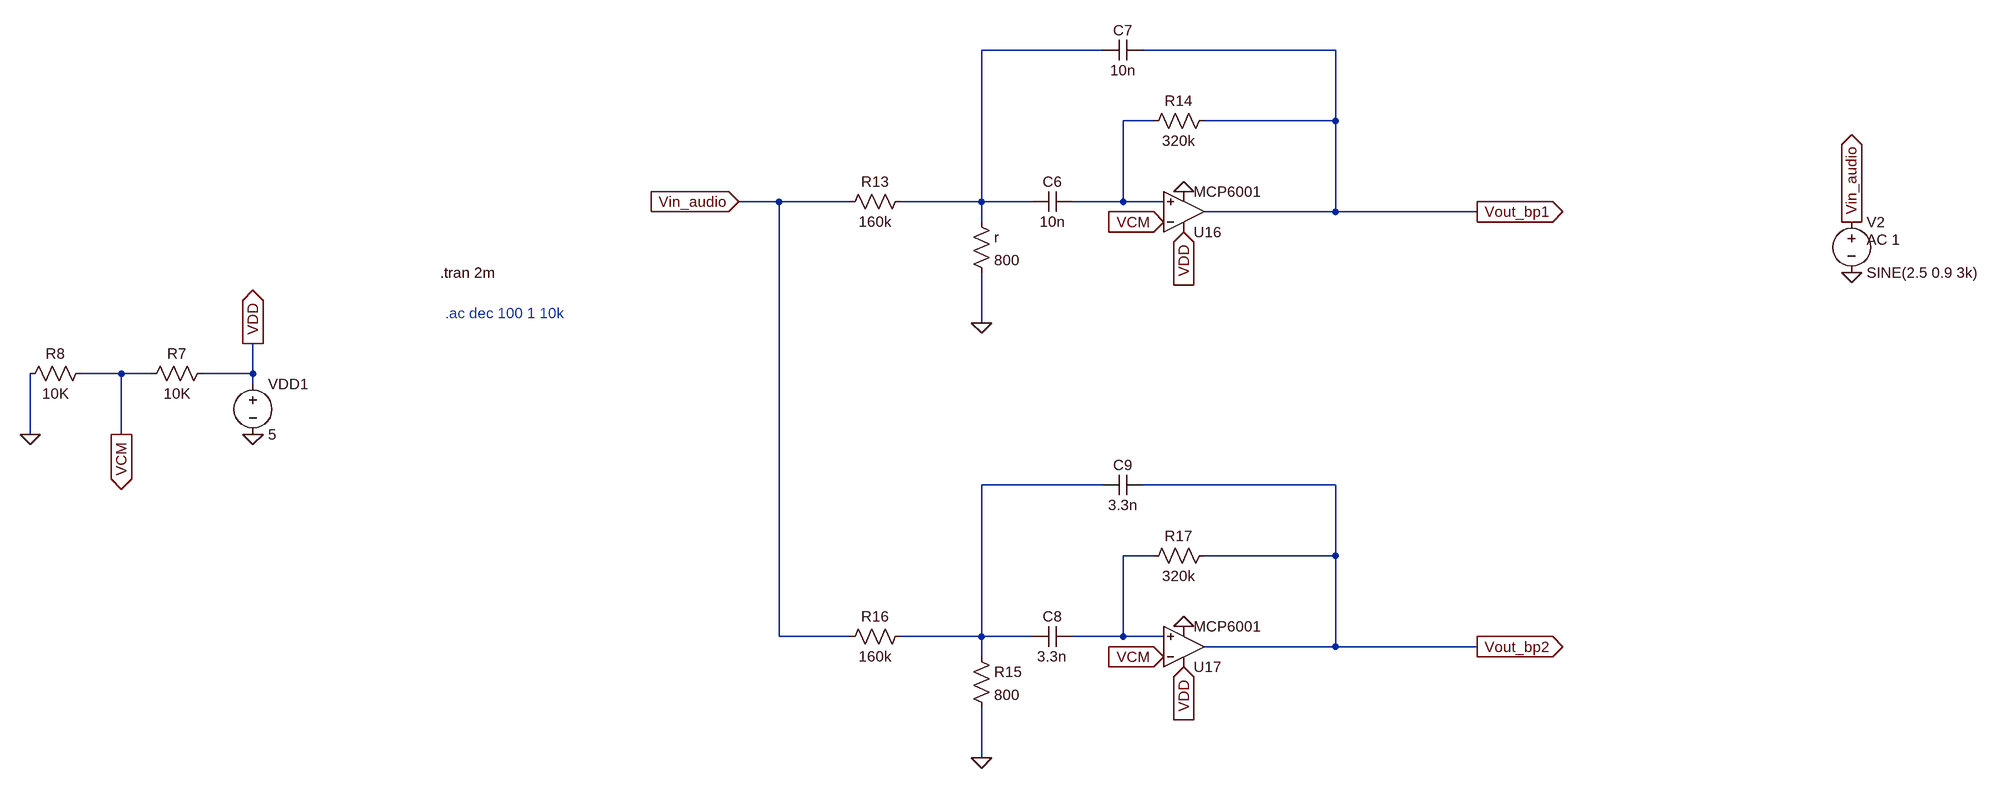
[diagram p0: schematic prelab_6.asc]
prelab_6.asc, the LTspice schematic file:
Version 4.1
SHEET 1 5788 1552
WIRE 4384 -432 4192 -432
WIRE 4752 -432 4448 -432
WIRE 4464 -320 4416 -320
WIRE 4752 -320 4752 -432
WIRE 4752 -320 4544 -320
WIRE 3872 -192 3808 -192
WIRE 3984 -192 3872 -192
WIRE 4192 -192 4192 -432
WIRE 4192 -192 4064 -192
WIRE 4272 -192 4192 -192
WIRE 4416 -192 4416 -320
WIRE 4416 -192 4336 -192
WIRE 4480 -192 4416 -192
WIRE 4752 -176 4752 -320
WIRE 4752 -176 4544 -176
WIRE 4976 -176 4752 -176
WIRE 4192 -160 4192 -192
WIRE 4192 0 4192 -80
WIRE 2832 80 2768 80
WIRE 2880 80 2832 80
WIRE 3040 80 3040 32
WIRE 3040 80 2960 80
WIRE 3040 96 3040 80
WIRE 2688 176 2688 80
WIRE 2832 176 2832 80
WIRE 4384 256 4192 256
WIRE 4752 256 4448 256
WIRE 4464 368 4416 368
WIRE 4752 368 4752 256
WIRE 4752 368 4544 368
WIRE 3872 496 3872 -192
WIRE 3984 496 3872 496
WIRE 4192 496 4192 256
WIRE 4192 496 4064 496
WIRE 4272 496 4192 496
WIRE 4416 496 4416 368
WIRE 4416 496 4336 496
WIRE 4480 496 4416 496
WIRE 4752 512 4752 368
WIRE 4752 512 4544 512
WIRE 4976 512 4752 512
WIRE 4192 528 4192 496
WIRE 4192 688 4192 608
FLAG 3040 176 0
FLAG 3040 32 VDD
IOPIN 3040 32 Out
FLAG 2832 176 VCM
IOPIN 2832 176 Out
FLAG 2688 176 0
FLAG 4976 -176 Vout_bp1
IOPIN 4976 -176 Out
FLAG 4192 0 0
FLAG 3808 -192 Vin_audio
IOPIN 3808 -192 In
FLAG 4480 -160 VCM
IOPIN 4480 -160 In
FLAG 4976 512 Vout_bp2
IOPIN 4976 512 Out
FLAG 4192 688 0
FLAG 4480 528 VCM
IOPIN 4480 528 In
FLAG 4512 -144 VDD
IOPIN 4512 -144 In
FLAG 4512 544 VDD
IOPIN 4512 544 In
FLAG 4512 -208 0
FLAG 4512 480 0
FLAG 5568 -80 0
FLAG 5568 -160 Vin_audio
IOPIN 5568 -160 Out
SYMBOL voltage 3040 80 R0
WINDOW 123 0 0 Left 0
WINDOW 39 0 0 Left 0
SYMATTR InstName VDD1
SYMATTR Value 5
SYMBOL res 2976 64 R90
WINDOW 0 0 56 VBottom 2
WINDOW 3 32 56 VTop 2
SYMATTR InstName R7
SYMATTR Value 10K
SYMBOL res 2784 64 R90
WINDOW 0 0 56 VBottom 2
WINDOW 3 32 56 VTop 2
SYMATTR InstName R8
SYMATTR Value 10K
SYMBOL MCP6001 4512 -176 M180
SYMATTR InstName U16
SYMBOL cap 4336 -208 R90
WINDOW 0 0 32 VBottom 2
WINDOW 3 32 32 VTop 2
SYMATTR InstName C6
SYMATTR Value 10n
SYMBOL res 4176 -176 R0
SYMATTR InstName r
SYMATTR Value 800
SYMBOL res 4080 -208 R90
WINDOW 0 0 56 VBottom 2
WINDOW 3 32 56 VTop 2
SYMATTR InstName R13
SYMATTR Value 160k
SYMBOL cap 4448 -448 R90
WINDOW 0 0 32 VBottom 2
WINDOW 3 32 32 VTop 2
SYMATTR InstName C7
SYMATTR Value 10n
SYMBOL res 4560 -336 R90
WINDOW 0 0 56 VBottom 2
WINDOW 3 32 56 VTop 2
SYMATTR InstName R14
SYMATTR Value 320k
SYMBOL MCP6001 4512 512 M180
SYMATTR InstName U17
SYMBOL cap 4336 480 R90
WINDOW 0 0 32 VBottom 2
WINDOW 3 32 32 VTop 2
SYMATTR InstName C8
SYMATTR Value 3.3n
SYMBOL res 4176 512 R0
SYMATTR InstName R15
SYMATTR Value 800
SYMBOL res 4080 480 R90
WINDOW 0 0 56 VBottom 2
WINDOW 3 32 56 VTop 2
SYMATTR InstName R16
SYMATTR Value 160k
SYMBOL cap 4448 240 R90
WINDOW 0 0 32 VBottom 2
WINDOW 3 32 32 VTop 2
SYMATTR InstName C9
SYMATTR Value 3.3n
SYMBOL res 4560 352 R90
WINDOW 0 0 56 VBottom 2
WINDOW 3 32 56 VTop 2
SYMATTR InstName R17
SYMATTR Value 320k
SYMBOL voltage 5568 -176 R0
WINDOW 123 24 44 Left 2
WINDOW 39 0 0 Left 0
SYMATTR Value2 AC 1
SYMATTR InstName V2
SYMATTR Value SINE(2.5 0.9 3k)
TEXT 3336 -80 Left 2 !.tran 2m
TEXT 3344 -16 Left 2 ;.ac dec 100 1 10k

The netlist it stands for:
* prelab_6.asc
VDD1 VDD 0 5
R7 VDD VCM 10K
R8 VCM 0 10K
* U16: MCP6001 (symbol MCP6001 not available, pins judged from their places): In+=N002 In-=VCM V+=VDD V-=0 OUT=Vout_bp1
C6 N002 N001 10n
r N001 0 800
R13 N001 Vin_audio 160k
C7 Vout_bp1 N001 10n
R14 Vout_bp1 N002 320k
* U17: MCP6001 (symbol MCP6001 not available, pins judged from their places): In+=N004 In-=VCM V+=VDD V-=0 OUT=Vout_bp2
C8 N004 N003 3.3n
R15 N003 0 800
R16 N003 Vin_audio 160k
C9 Vout_bp2 N003 3.3n
R17 Vout_bp2 N004 320k
V2 Vin_audio 0 SINE(2.5 0.9 3k) AC 1
.tran 2m
* .ac dec 100 1 10k
.backanno
.end